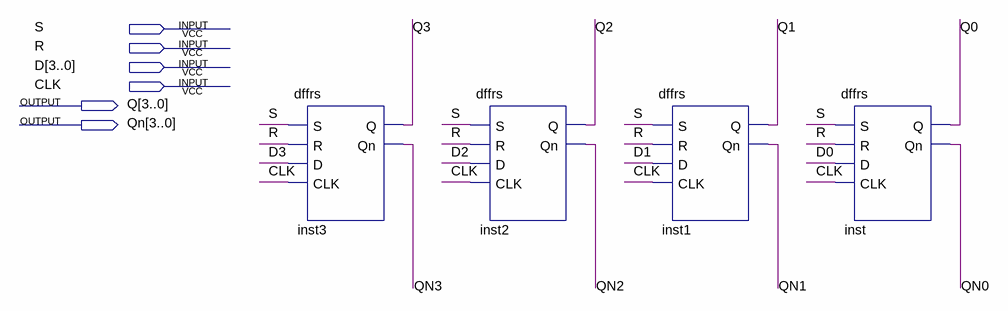
[diagram p0: schematic sheet]
// Quartus schematic reg4bits.bdf as structural Verilog: 4 symbols, 6 pins
module reg4bits (
  input  S,
  input  R,
  input  [3:0] D,
  input  CLK,
  output [3:0] Q,
  output [3:0] Qn
);

  dffrs inst3 (.S(S), .R(R), .D(D[3]), .CLK(CLK), .Q(Q[3]), .Qn(Qn[3]));
  dffrs inst2 (.S(S), .R(R), .D(D[2]), .CLK(CLK), .Q(Q[2]), .Qn(Qn[2]));
  dffrs inst1 (.S(S), .R(R), .D(D[1]), .CLK(CLK), .Q(Q[1]), .Qn(Qn[1]));
  dffrs inst (.S(S), .R(R), .D(D[0]), .CLK(CLK), .Q(Q[0]), .Qn(Qn[0]));
endmodule
